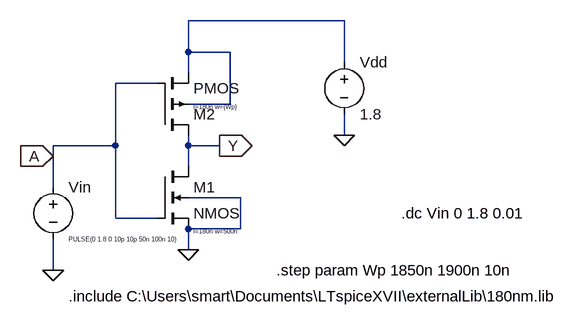
[diagram p0: schematic CMOSInverter.asc]
CMOSInverter.asc, the LTspice schematic file:
Version 4
SHEET 1 880 680
WIRE 352 -32 112 -32
WIRE 112 16 112 -32
WIRE 176 16 112 16
WIRE 352 32 352 -32
WIRE 112 48 112 16
WIRE 64 64 0 64
WIRE 176 96 176 16
WIRE 176 96 112 96
WIRE 352 144 352 112
WIRE 0 160 0 64
WIRE 0 160 -96 160
WIRE 112 160 112 144
WIRE 160 160 112 160
WIRE -96 176 -96 160
WIRE 112 192 112 160
WIRE -96 224 -96 176
WIRE 192 240 112 240
WIRE 0 272 0 160
WIRE 64 272 0 272
WIRE 192 288 192 240
WIRE 192 288 112 288
WIRE 112 320 112 288
WIRE -96 352 -96 304
FLAG 352 144 0
FLAG 112 320 0
FLAG -96 352 0
FLAG -96 176 A
IOPIN -96 176 In
FLAG 160 160 Y
IOPIN 160 160 Out
SYMBOL nmos4 64 192 R0
WINDOW 123 56 100 Left 0
SYMATTR Value2 l=180n w=500n
SYMATTR InstName M1
SYMBOL pmos4 64 144 M180
WINDOW 123 56 44 Left 0
SYMATTR Value2 l=180n w={Wp}
SYMATTR InstName M2
SYMBOL voltage 352 16 R0
WINDOW 123 0 0 Left 0
WINDOW 39 0 0 Left 0
SYMATTR InstName Vdd
SYMATTR Value 1.8
SYMBOL voltage -96 208 R0
WINDOW 3 24 96 Left 0
WINDOW 123 0 0 Left 0
WINDOW 39 0 0 Left 0
SYMATTR Value PULSE(0 1.8 0 10p 10p 50n 100n 10)
SYMATTR InstName Vin
TEXT 440 264 Left 2 !.dc Vin 0 1.8 0.01
TEXT -72 392 Left 2 !.include C:\\Users\\smart\\Documents\\LTspiceXVII\\externalLib\\180nm.lib
TEXT 248 352 Left 2 !.step param Wp 1850n 1900n 10n

The netlist it stands for:
* CMOSInverter.asc
M1 Y A 0 0 NMOS l=180n w=500n
M2 Y A N001 N001 PMOS l=180n w={Wp}
Vdd N001 0 1.8
Vin A 0 PULSE(0 1.8 0 10p 10p 50n 100n 10)
.model NMOS NMOS
.model PMOS PMOS
.lib standard.mos
.dc Vin 0 1.8 0.01
.include C:\Users\smart\Documents\LTspiceXVII\externalLib\180nm.lib
.step param Wp 1850n 1900n 10n
.backanno
.end

* Results of the author's LTspice run, read from the files saved beside the schematic
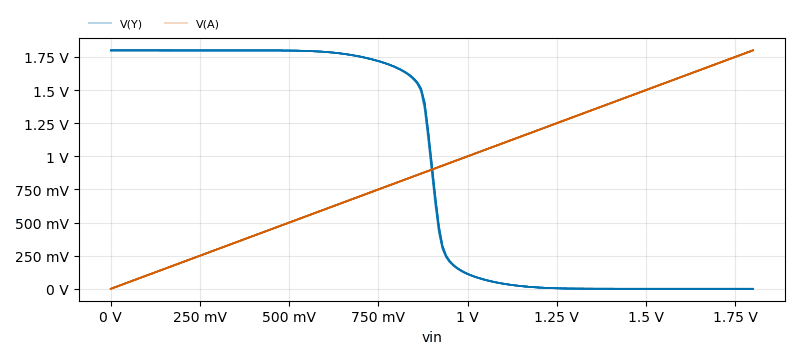
[diagram p1: DC transfer characteristic of CMOSInverter.asc, plotted from the saved traces]
* DC transfer characteristic, 6 runs:
*   V(Y) [wp=1.85e-006]: 1.8 V at vin=0 V, 5.922 nV at vin=1.8 V, min 5.922 nV, max 1.8 V
*   V(Y) [wp=1.86e-006]: 1.8 V at vin=0 V, 5.939 nV at vin=1.8 V, min 5.939 nV, max 1.8 V
*   V(Y) [wp=1.87e-006]: 1.8 V at vin=0 V, 5.957 nV at vin=1.8 V, min 5.957 nV, max 1.8 V
*   V(Y) [wp=1.88e-006]: 1.8 V at vin=0 V, 5.974 nV at vin=1.8 V, min 5.974 nV, max 1.8 V
*   V(Y) [wp=1.89e-006]: 1.8 V at vin=0 V, 5.992 nV at vin=1.8 V, min 5.992 nV, max 1.8 V
*   V(Y) [wp=1.9e-006]: 1.8 V at vin=0 V, 6.009 nV at vin=1.8 V, min 6.009 nV, max 1.8 V
*   V(A) [wp=1.85e-006]: 0 V at vin=0 V, 1.8 V at vin=1.8 V, min 0 V, max 1.8 V
*   V(A) [wp=1.86e-006]: 0 V at vin=0 V, 1.8 V at vin=1.8 V, min 0 V, max 1.8 V
*   V(A) [wp=1.87e-006]: 0 V at vin=0 V, 1.8 V at vin=1.8 V, min 0 V, max 1.8 V
*   V(A) [wp=1.88e-006]: 0 V at vin=0 V, 1.8 V at vin=1.8 V, min 0 V, max 1.8 V
*   V(A) [wp=1.89e-006]: 0 V at vin=0 V, 1.8 V at vin=1.8 V, min 0 V, max 1.8 V
*   V(A) [wp=1.9e-006]: 0 V at vin=0 V, 1.8 V at vin=1.8 V, min 0 V, max 1.8 V